# Altium schematic sheet Relais sheet.SchDoc: Relay Sheet
size A4; Date: 15/02/2018; CheckedBy: Mr. Pauwels; Author: Robbie Smedts; CompanyName: KU Leuven; DrawnBy: Robbie Smedts; Engineer: Robbie Smedts & Vincent Agemans; Organization: Thomas More; DocumentNumber: 3; Revision: 2; SheetNumber: 3; SheetTotal: 5
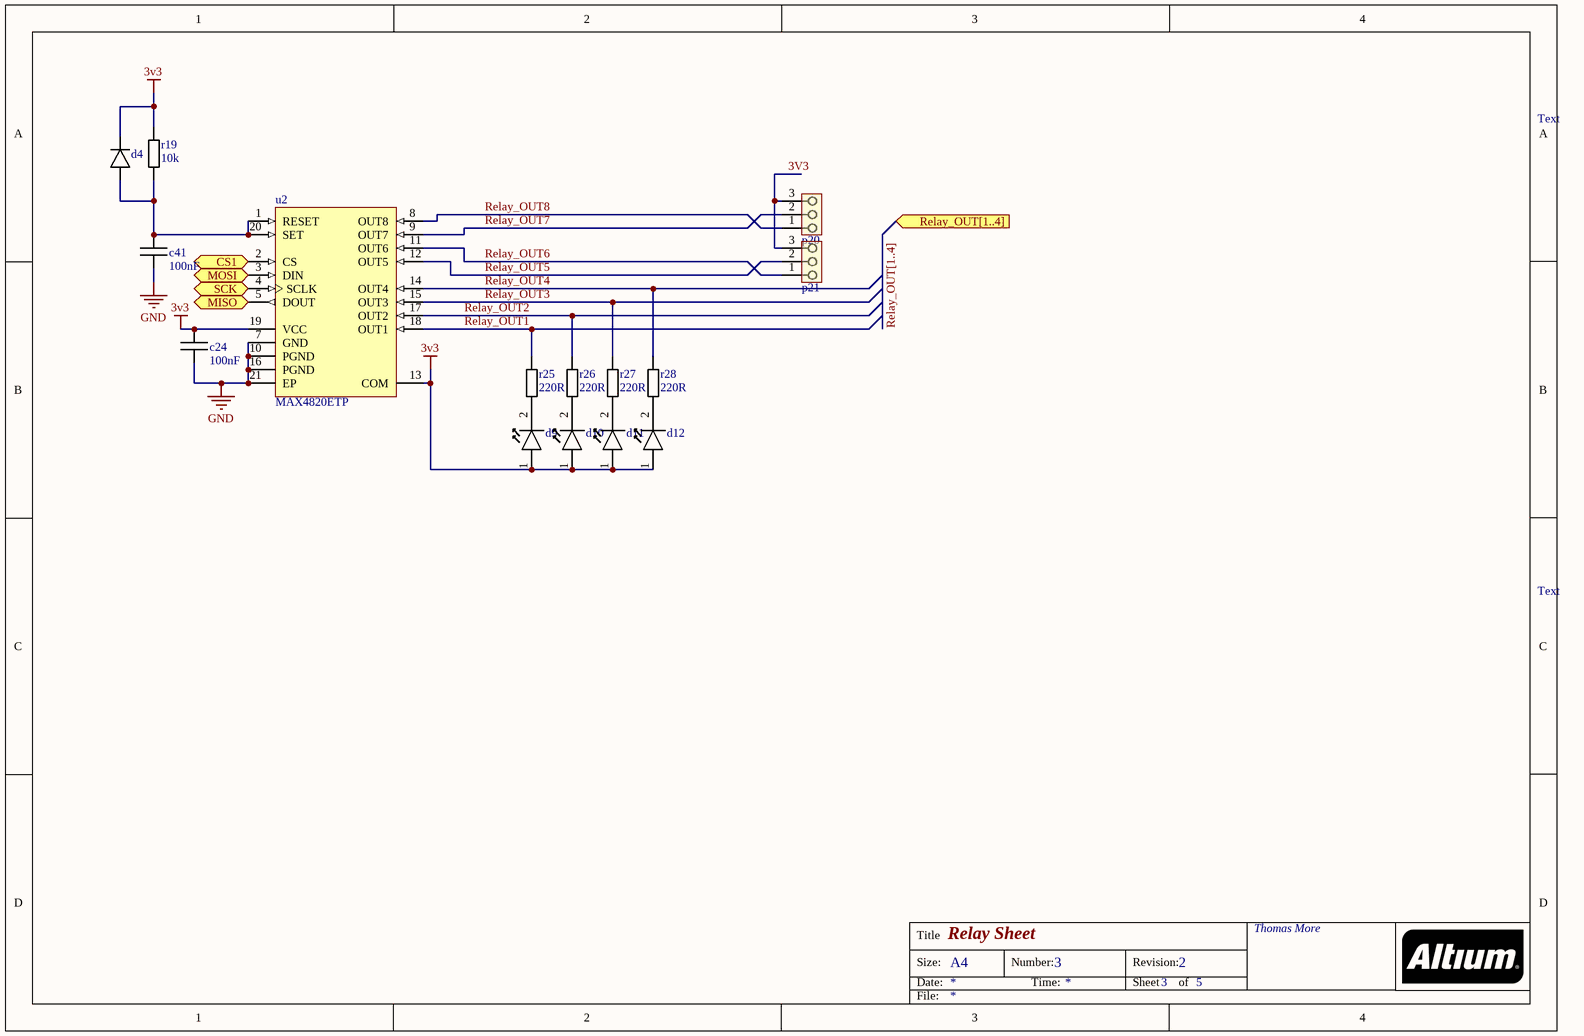
[diagram p0: Relais sheet.SchDoc]

## Parts
c24  100nF  [0805]
c41  100nF  [0603]
d4  CD1206-S01575  [1206 - DIODE]  (value not drawn)
d9  Yellow SMD LED  [0603 - LED]  (value not drawn)
d10  Yellow SMD LED  [0603 - LED]  (value not drawn)
d11  Yellow SMD LED  [0603 - LED]  (value not drawn)
d12  Yellow SMD LED  [0603 - LED]  (value not drawn)
p20  Wire-to-Board 3P  [1X3 Headerpin Angled]  (value not drawn)
p21  Wire-to-Board 3P  [1X3 Headerpin Angled]  (value not drawn)
r19  10k  [0603]
r25  220R  [0603]
r26  220R  [0603]
r27  220R  [0603]
r28  220R  [0603]
u2  MAX4820ETP  [TQFN-20]

## Ports
CS1 (in), MISO (out), MOSI (in), Relay_OUT[1..4] (in), SCK (in)

## Nets
3V3: c24.1 d4.1(Kathode) d9.1(Anode) d10.1(Anode) d11.1(Anode) d12.1(Anode) p20.3 p21.3 r19.2 u2.13(COM) u2.19(VCC)
GND: c24.2 c41.1 u2.0(EP) u2.7(GND) u2.10(PGND) u2.16(PGND) u2.21(EP)
CS1: u2.2(CS) ; port CS1
MISO: u2.5(DOUT) ; port MISO
MOSI: u2.3(DIN) ; port MOSI
Relay_OUT1: r25.2 u2.18(OUT1)
Relay_OUT2: r26.2 u2.17(OUT2)
Relay_OUT3: r27.2 u2.15(OUT3)
Relay_OUT4: r28.2 u2.14(OUT4)
Relay_OUT5: p21.2 u2.12(OUT5)
Relay_OUT6: p21.1 u2.11(OUT6)
Relay_OUT7: p20.2 u2.9(OUT7)
Relay_OUT8: p20.1 u2.8(OUT8)
SCK: u2.4(SCLK) ; port SCK
Netc41_2: c41.2 d4.2(Anode) r19.1 u2.1(RESET) u2.20(SET)
Netd9_2: d9.2(Kathode) r25.1
Netd10_2: d10.2(Kathode) r26.1
Netd11_2: d11.2(Kathode) r27.1
Netd12_2: d12.2(Kathode) r28.1

## Buses and harness runs
bus Relay_OUT[1..4] = port Relay_OUT[1..4]

## Notes on the sheet
- Text
- Title
- Size:
- Date:
- A4
- Number:
- Time:
- Revision:
- Sheet
- of
- File:

## Library data of the parts
c24 = 0805 Capacitor: ...F
c41 = 0603 Capacitor: ...F
d4 = CD1206-S01575: Switching Chip Diode
d9-d12 = Yellow SMD LED: 0603 Package
r19 r25-r28 = 0603 Resistor: ...R
u2 = MAX4820ETP: 20 TQFN-EP